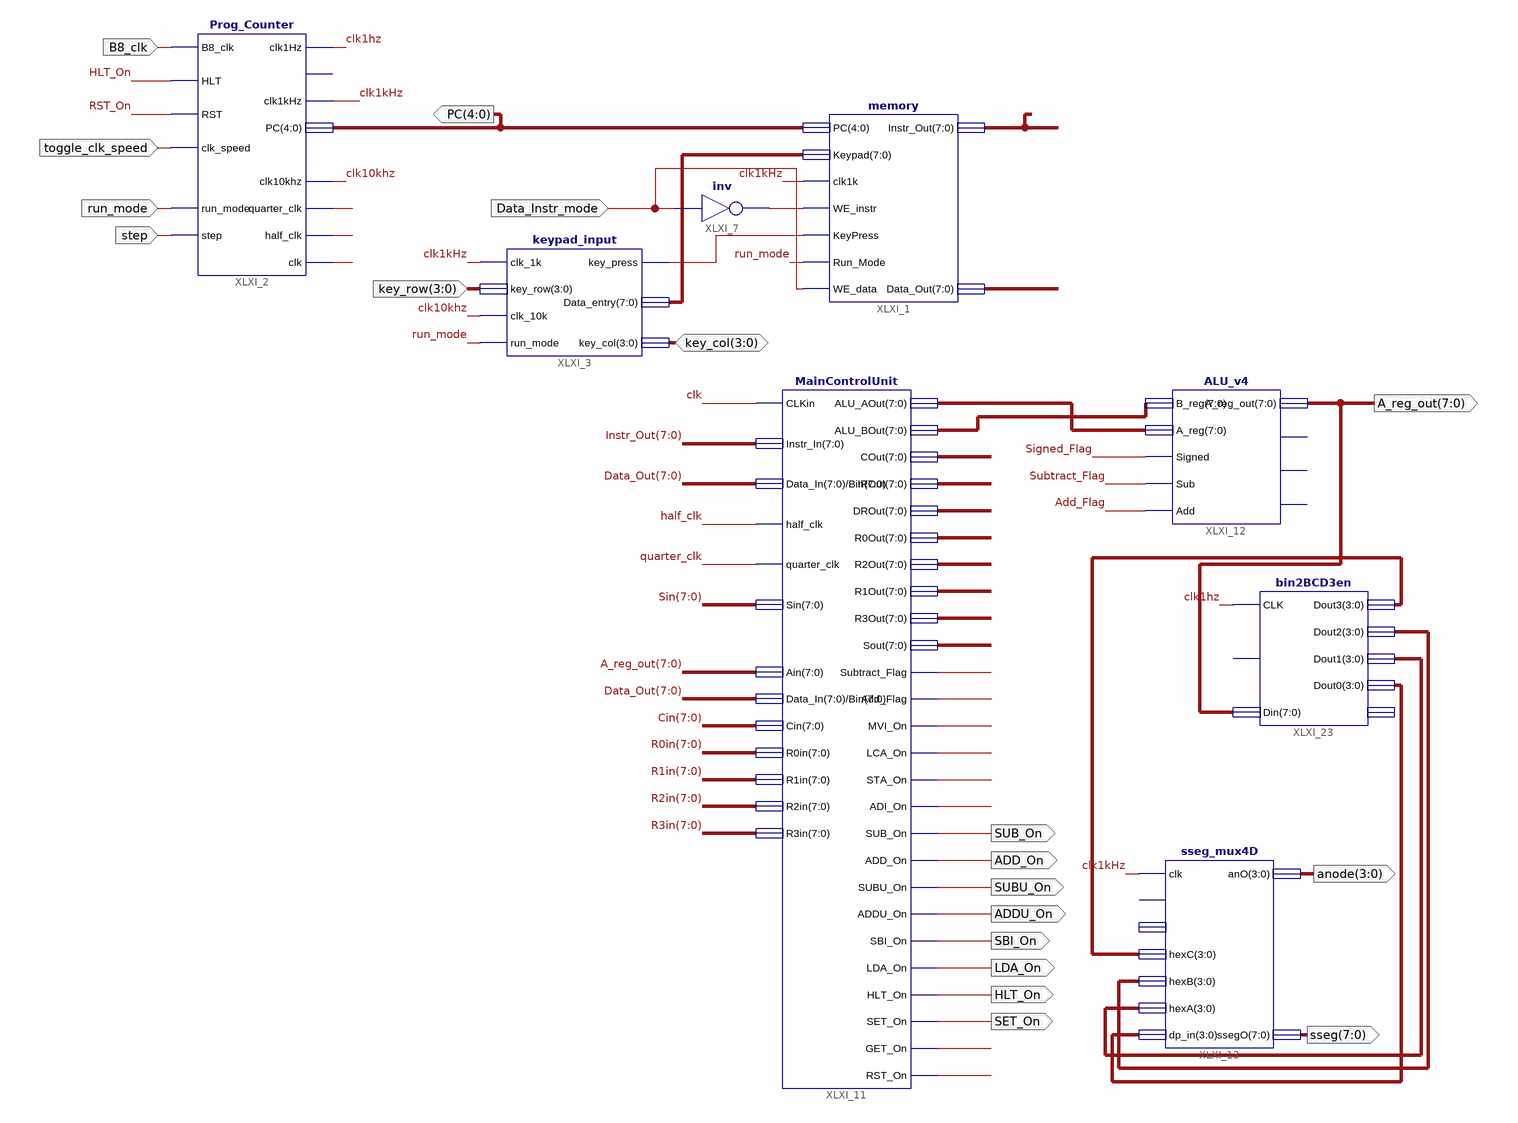
[diagram p0: schematic sheet 1]
// Xilinx ISE schematic final_v1.sch (spartan3e) as structural Verilog: 8 symbols, 19 ports
module final_v1 (
  input  Data_Instr_mode,
  input  step,
  input  run_mode,
  input  toggle_clk_speed,
  input  B8_clk,
  input  [3:0] key_row,
  inout  [3:0] key_col,
  output HLT_On,
  output [7:0] A_reg_out,
  output SUB_On,
  output ADD_On,
  output SUBU_On,
  output ADDU_On,
  output SBI_On,
  output LDA_On,
  output SET_On,
  output [4:0] PC,
  output [3:0] anode,
  output [7:0] sseg
);

  wire Add_Flag, ADI_On, clk, clk1hz, clk1kHz, clk10khz, GET_On, half_clk, LCA_On, MVI_On, quarter_clk,
       RST_On, Signed_Flag, STA_On, Subtract_Flag, XLXN_14, XLXN_225;
  wire [3:0] XLXN_263, XLXN_264, XLXN_265, XLXN_266;
  wire [7:0] Cin, Data_Out, Instr_Out, keypadOut, R0in, R1in, R2in, R3in, Sin, XLXN_92, XLXN_93, XLXN_94,
       XLXN_95, XLXN_96, XLXN_97, XLXN_98, XLXN_99, XLXN_222, XLXN_223;

  ALU_v4 XLXI_12 (
    .B_reg(XLXN_222), .A_reg(XLXN_223), .Signed(Signed_Flag), .Sub(Subtract_Flag), .Add(Add_Flag),
    .A_reg_out(A_reg_out));  // open: Neg_flag, Zero_flag, Overflow_flag
  MainControlUnit XLXI_11 (
    .CLKin(clk), .Instr_In(Instr_Out), .Data_In(Data_Out), .half_clk(half_clk), .quarter_clk(quarter_clk),
    .Ain(A_reg_out), .Bin(Data_Out), .Cin(Cin), .R0in(R0in), .R1in(R1in), .R2in(R2in), .R3in(R3in),
    .Sin(Sin), .MVI_On(MVI_On), .LCA_On(LCA_On), .STA_On(STA_On), .ADI_On(ADI_On), .SUB_On(SUB_On),
    .ADD_On(ADD_On), .SUBU_On(SUBU_On), .ADDU_On(ADDU_On), .SBI_On(SBI_On), .LDA_On(LDA_On), .HLT_On(HLT_On),
    .SET_On(SET_On), .GET_On(GET_On), .ALU_AOut(XLXN_223), .ALU_BOut(XLXN_222), .COut(XLXN_98),
    .IROut(XLXN_99), .DROut(XLXN_97), .R0Out(XLXN_96), .R2Out(XLXN_95), .R1Out(XLXN_94), .R3Out(XLXN_93),
    .Sout(XLXN_92), .Subtract_Flag(Subtract_Flag), .Add_Flag(Add_Flag), .RST_On(RST_On));
  Prog_Counter XLXI_2 (
    .HLT(HLT_On), .run_mode(run_mode), .B8_clk(B8_clk), .RST(RST_On), .step(step),
    .clk_speed(toggle_clk_speed), .clk1Hz(clk1hz), .quarter_clk(quarter_clk), .clk1kHz(clk1kHz),
    .clk10khz(clk10khz), .PC(PC), .half_clk(half_clk), .clk(clk));  // open: clk1MHz
  memory XLXI_1 (
    .PC(PC), .Keypad(keypadOut), .clk1k(clk1kHz), .WE_instr(XLXN_14), .KeyPress(XLXN_225),
    .Run_Mode(run_mode), .WE_data(Data_Instr_mode), .Instr_Out(Instr_Out), .Data_Out(Data_Out));
  keypad_input XLXI_3 (
    .clk_1k(clk1kHz), .key_row(key_row), .clk_10k(clk10khz), .run_mode(run_mode), .key_col(key_col),
    .key_press(XLXN_225), .Data_entry(keypadOut));
  not XLXI_7 (XLXN_14, Data_Instr_mode);
  bin2BCD3en XLXI_23 (
    .CLK(clk1hz), .Din(A_reg_out), .Dout3(XLXN_266), .Dout2(XLXN_265), .Dout1(XLXN_264), .Dout0(XLXN_263));  // open: En, RBout
  sseg_mux4D XLXI_13 (
    .clk(clk1kHz), .hexC(XLXN_266), .hexB(XLXN_265), .hexA(XLXN_264), .dp_in(XLXN_263), .anO(anode),
    .ssegO(sseg));  // open: rb_in, hexD
endmodule
